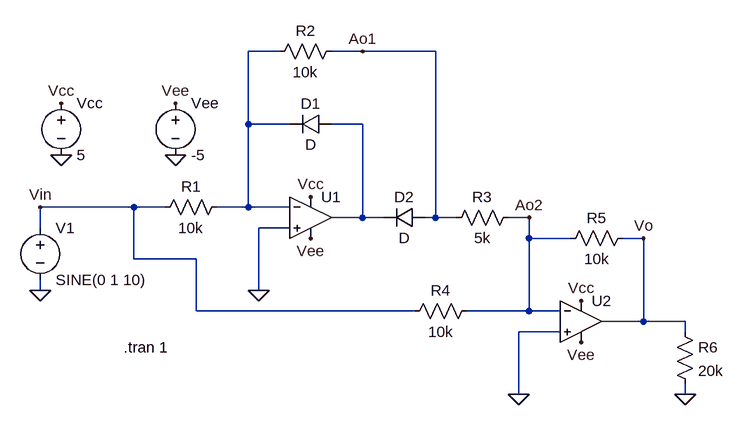
[diagram p0: schematic PrecisionFullWaveRectifier.asc]
PrecisionFullWaveRectifier.asc, the LTspice schematic file:
Version 4
SHEET 1 880 680
WIRE 160 -112 112 -112
WIRE 288 -112 240 -112
WIRE 400 -112 288 -112
WIRE 112 0 112 -112
WIRE 176 0 112 0
WIRE 288 0 240 0
WIRE -64 128 -208 128
WIRE -16 128 -64 128
WIRE 112 128 112 0
WIRE 112 128 64 128
WIRE 176 128 112 128
WIRE 288 144 288 0
WIRE 288 144 240 144
WIRE 320 144 288 144
WIRE 400 144 400 -112
WIRE 400 144 384 144
WIRE 432 144 400 144
WIRE 544 144 512 144
WIRE -208 160 -208 128
WIRE 176 160 128 160
WIRE 544 176 544 144
WIRE 608 176 544 176
WIRE 720 176 688 176
WIRE -64 208 -64 128
WIRE 32 208 -64 208
WIRE -208 256 -208 240
WIRE 128 256 128 160
WIRE 32 288 32 208
WIRE 368 288 32 288
WIRE 544 288 544 176
WIRE 544 288 448 288
WIRE 592 288 544 288
WIRE 720 304 720 176
WIRE 720 304 656 304
WIRE 784 304 720 304
WIRE 592 320 528 320
WIRE 784 320 784 304
WIRE 528 416 528 320
WIRE 784 416 784 400
FLAG -176 48 0
FLAG 0 48 0
FLAG 208 112 Vcc
FLAG 208 176 Vee
FLAG 528 416 0
FLAG -208 256 0
FLAG -208 128 Vin
FLAG 288 -112 Ao1
FLAG 624 272 Vcc
FLAG 624 336 Vee
FLAG 784 416 0
FLAG 544 144 Ao2
FLAG 720 176 Vo
FLAG 128 256 0
FLAG -176 -32 Vcc
FLAG 0 -32 Vee
SYMBOL OpAmps\\UniversalOpAmp 208 144 R0
SYMATTR InstName U1
SYMBOL voltage -176 -48 R0
WINDOW 123 0 0 Left 0
WINDOW 39 0 0 Left 0
SYMATTR InstName Vcc
SYMATTR Value 5
SYMBOL voltage 0 -48 R0
WINDOW 123 0 0 Left 0
WINDOW 39 0 0 Left 0
SYMATTR InstName Vee
SYMATTR Value -5
SYMBOL voltage -208 144 R0
WINDOW 123 0 0 Left 0
WINDOW 39 0 0 Left 0
SYMATTR InstName V1
SYMATTR Value SINE(0 1 10)
SYMBOL res 80 112 R90
WINDOW 0 0 56 VBottom 2
WINDOW 3 32 56 VTop 2
SYMATTR InstName R1
SYMATTR Value 10k
SYMBOL res 256 -128 R90
WINDOW 0 0 56 VBottom 2
WINDOW 3 32 56 VTop 2
SYMATTR InstName R2
SYMATTR Value 10k
SYMBOL res 528 128 R90
WINDOW 0 0 56 VBottom 2
WINDOW 3 32 56 VTop 2
SYMATTR InstName R3
SYMATTR Value 5k
SYMBOL diode 240 -16 R90
WINDOW 0 0 32 VBottom 2
WINDOW 3 32 32 VTop 2
SYMATTR InstName D1
SYMBOL diode 384 128 R90
WINDOW 0 0 32 VBottom 2
WINDOW 3 32 32 VTop 2
SYMATTR InstName D2
SYMBOL OpAmps\\UniversalOpAmp 624 304 R0
SYMATTR InstName U2
SYMBOL res 464 272 R90
WINDOW 0 0 56 VBottom 2
WINDOW 3 32 56 VTop 2
SYMATTR InstName R4
SYMATTR Value 10k
SYMBOL res 704 160 R90
WINDOW 0 0 56 VBottom 2
WINDOW 3 32 56 VTop 2
SYMATTR InstName R5
SYMATTR Value 10k
SYMBOL res 768 304 R0
SYMATTR InstName R6
SYMATTR Value 20k
TEXT -80 344 Left 2 !.tran 1

The netlist it stands for:
* PrecisionFullWaveRectifier.asc
XU1 0 N001 Vcc Vee N002 level1 Avol=1Meg GBW=10Meg Vos=0 En=0 Enk=0 In=0 Ink=0 Rin=500Meg  ; pins In+ In- V+ V- OUT
Vcc Vcc 0 5
Vee Vee 0 -5
V1 Vin 0 SINE(0 1 10)
R1 N001 Vin 10k
R2 Ao1 N001 10k
R3 Ao2 Ao1 5k
D1 N002 N001 D
D2 Ao1 N002 D
XU2 0 Ao2 Vcc Vee Vo level1 Avol=1Meg GBW=10Meg Vos=0 En=0 Enk=0 In=0 Ink=0 Rin=500Meg  ; pins In+ In- V+ V- OUT
R4 Ao2 Vin 10k
R5 Vo Ao2 10k
R6 Vo 0 20k
.model D D
.lib standard.dio
.tran 1
.lib UniversalOpAmp1.lib
.backanno
.end